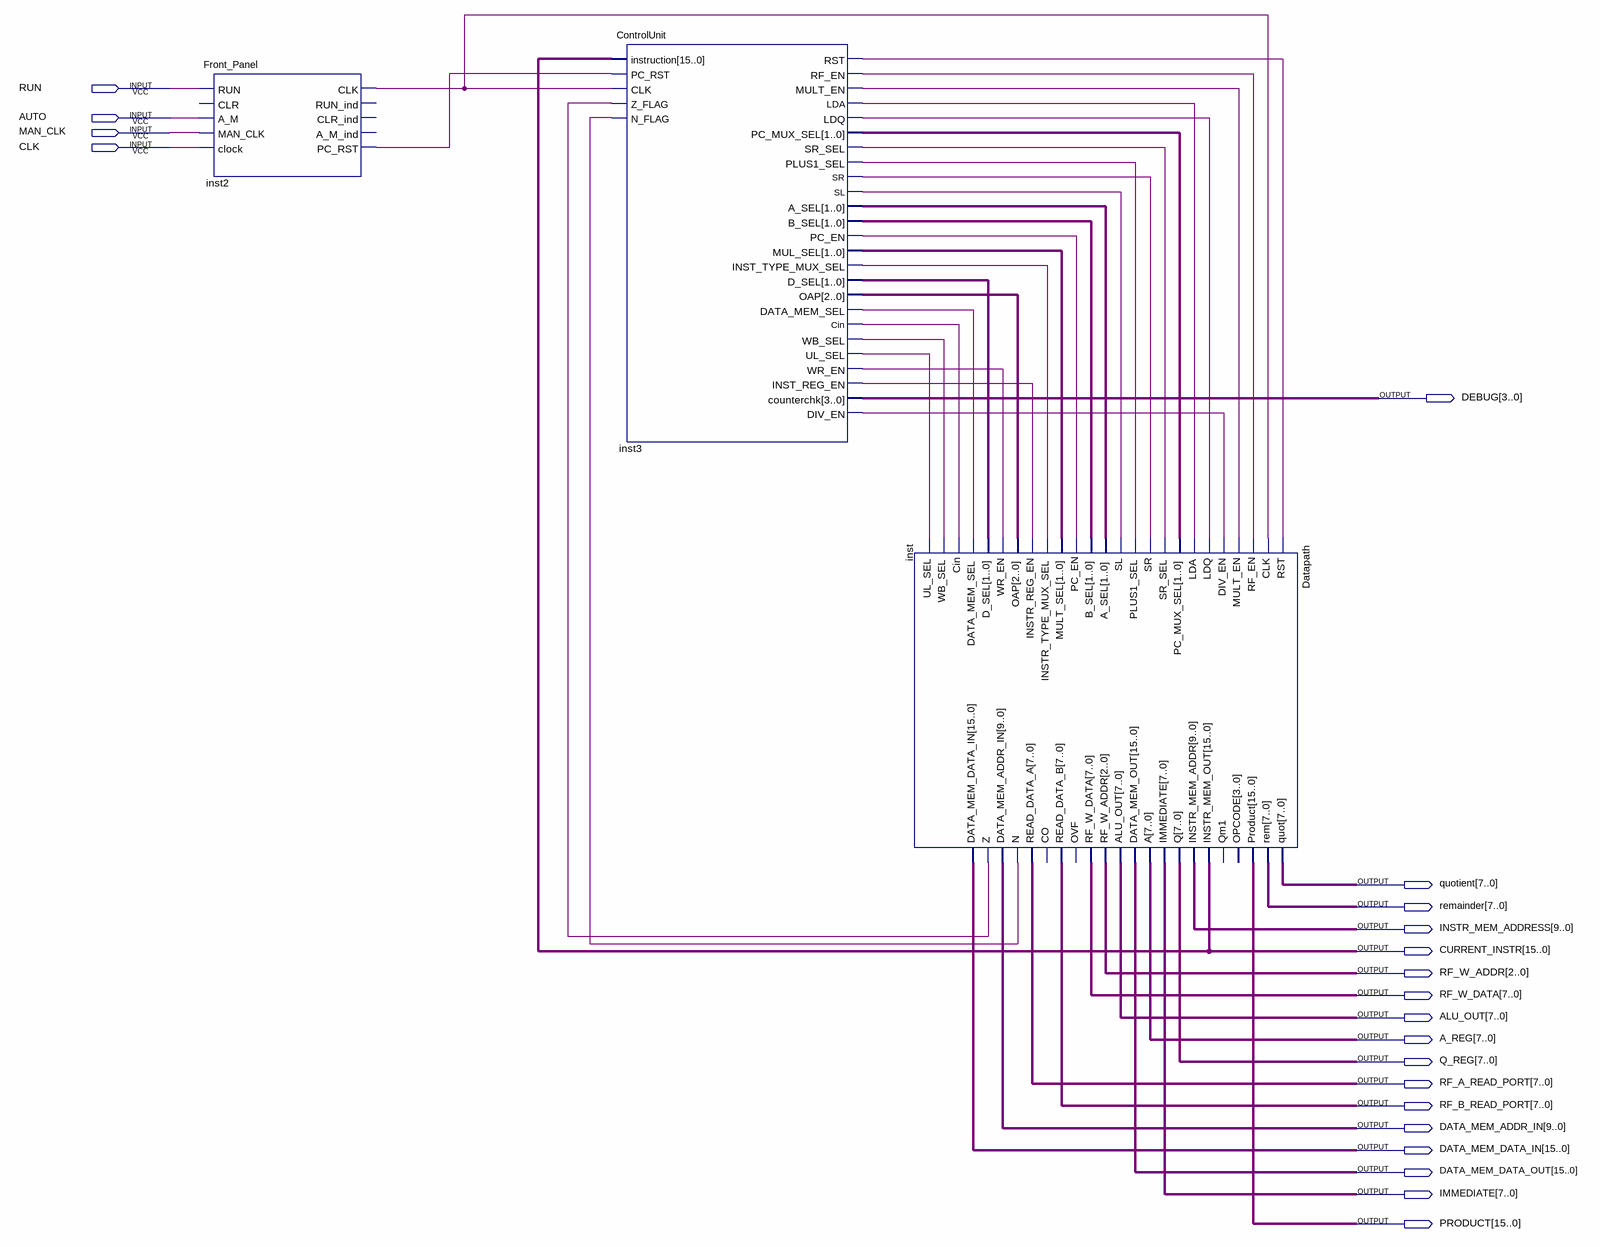
[diagram p0: schematic sheet]
// Quartus schematic CPU.bdf as structural Verilog: 3 symbols, 21 pins
module CPU (
  input  RUN,
  input  AUTO,
  input  MAN_CLK,
  input  CLK,
  output [3:0] DEBUG,
  output [7:0] quotient,
  output [7:0] remainder,
  output [9:0] INSTR_MEM_ADDRESS,
  output [15:0] CURRENT_INSTR,
  output [2:0] RF_W_ADDR,
  output [7:0] RF_W_DATA,
  output [7:0] ALU_OUT,
  output [7:0] A_REG,
  output [7:0] Q_REG,
  output [7:0] RF_A_READ_PORT,
  output [7:0] RF_B_READ_PORT,
  output [9:0] DATA_MEM_ADDR_IN,
  output [15:0] DATA_MEM_DATA_IN,
  output [15:0] DATA_MEM_DATA_OUT,
  output [7:0] IMMEDIATE,
  output [15:0] PRODUCT
);

  wire inst2_clk, inst2_pc_rst, inst3_cin, inst3_data_mem_sel, inst3_div_en, inst3_inst_reg_en,
       inst3_inst_type_mux_sel, inst3_lda, inst3_ldq, inst3_mult_en, inst3_pc_en, inst3_plus1_sel,
       inst3_rf_en, inst3_rst, inst3_sl, inst3_sr, inst3_sr_sel, inst3_ul_sel, inst3_wb_sel, inst3_wr_en,
       inst_n, inst_z;
  wire [1:0] inst3_a_sel, inst3_b_sel, inst3_d_sel, inst3_mul_sel, inst3_pc_mux_sel;
  wire [2:0] inst3_oap;

  Front_Panel inst2 (
    .RUN(RUN), .A_M(AUTO), .MAN_CLK(MAN_CLK), .clock(CLK), .CLK(inst2_clk), .PC_RST(inst2_pc_rst));  // open: CLR, RUN_ind, CLR_ind, A_M_ind
  ControlUnit inst3 (
    .instruction(CURRENT_INSTR), .PC_RST(inst2_pc_rst), .CLK(inst2_clk), .Z_FLAG(inst_z), .N_FLAG(inst_n),
    .RST(inst3_rst), .RF_EN(inst3_rf_en), .MULT_EN(inst3_mult_en), .LDA(inst3_lda), .LDQ(inst3_ldq),
    .PC_MUX_SEL(inst3_pc_mux_sel), .SR_SEL(inst3_sr_sel), .PLUS1_SEL(inst3_plus1_sel), .SR(inst3_sr),
    .SL(inst3_sl), .A_SEL(inst3_a_sel), .B_SEL(inst3_b_sel), .PC_EN(inst3_pc_en), .MUL_SEL(inst3_mul_sel),
    .INST_TYPE_MUX_SEL(inst3_inst_type_mux_sel), .D_SEL(inst3_d_sel), .OAP(inst3_oap),
    .DATA_MEM_SEL(inst3_data_mem_sel), .Cin(inst3_cin), .WB_SEL(inst3_wb_sel), .UL_SEL(inst3_ul_sel),
    .WR_EN(inst3_wr_en), .INST_REG_EN(inst3_inst_reg_en), .counterchk(DEBUG), .DIV_EN(inst3_div_en));
  Datapath inst (
    .RST(inst3_rst), .CLK(inst2_clk), .RF_EN(inst3_rf_en), .MULT_EN(inst3_mult_en), .DIV_EN(inst3_div_en),
    .LDQ(inst3_ldq), .LDA(inst3_lda), .PC_MUX_SEL(inst3_pc_mux_sel), .SR_SEL(inst3_sr_sel), .SR(inst3_sr),
    .PLUS1_SEL(inst3_plus1_sel), .SL(inst3_sl), .A_SEL(inst3_a_sel), .B_SEL(inst3_b_sel),
    .PC_EN(inst3_pc_en), .MULT_SEL(inst3_mul_sel), .INSTR_TYPE_MUX_SEL(inst3_inst_type_mux_sel),
    .INSTR_REG_EN(inst3_inst_reg_en), .OAP(inst3_oap), .WR_EN(inst3_wr_en), .D_SEL(inst3_d_sel),
    .DATA_MEM_SEL(inst3_data_mem_sel), .Cin(inst3_cin), .WB_SEL(inst3_wb_sel), .UL_SEL(inst3_ul_sel),
    .quot(quotient), .rem(remainder), .Product(PRODUCT), .INSTR_MEM_OUT(CURRENT_INSTR),
    .INSTR_MEM_ADDR(INSTR_MEM_ADDRESS), .Q(Q_REG), .IMMEDIATE(IMMEDIATE), .A(A_REG),
    .DATA_MEM_OUT(DATA_MEM_DATA_OUT), .ALU_OUT(ALU_OUT), .RF_W_ADDR(RF_W_ADDR), .RF_W_DATA(RF_W_DATA),
    .READ_DATA_B(RF_B_READ_PORT), .READ_DATA_A(RF_A_READ_PORT), .N(inst_n),
    .DATA_MEM_ADDR_IN(DATA_MEM_ADDR_IN), .Z(inst_z), .DATA_MEM_DATA_IN(DATA_MEM_DATA_IN));  // open: OPCODE, Qm1, OVF, CO
endmodule
